# Altium project LORAbridge.PrjPcb
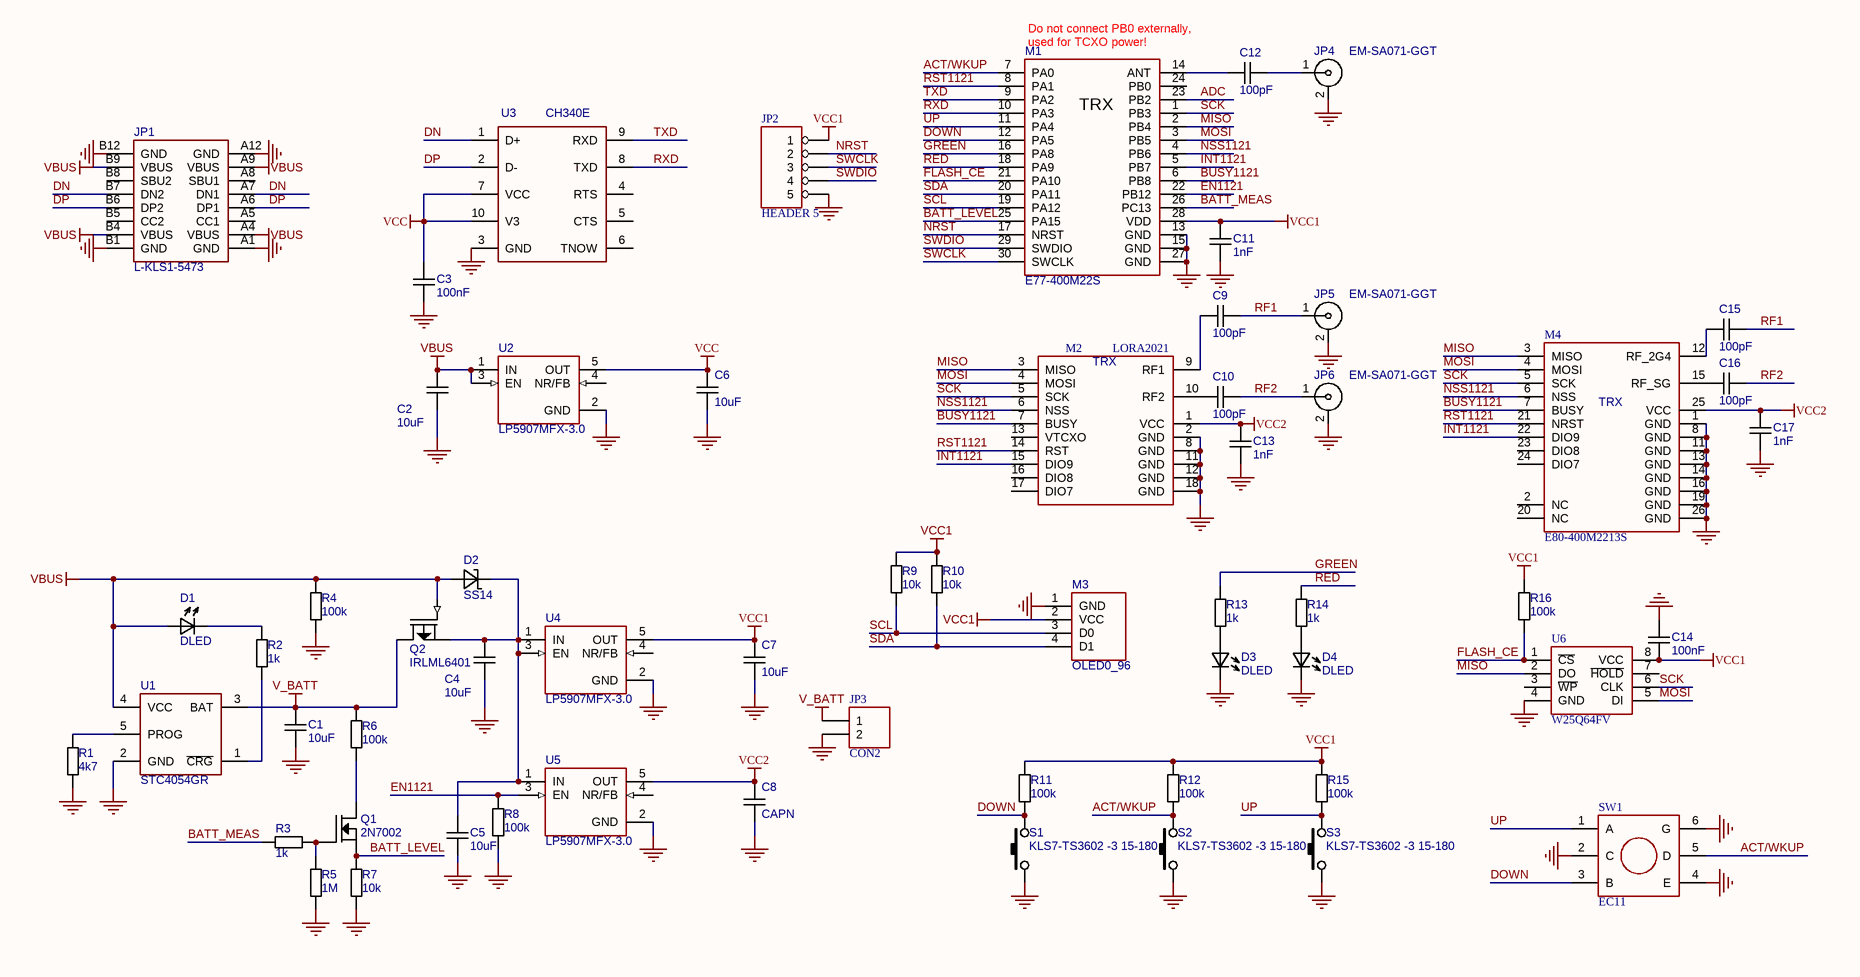
[diagram p0: LB77.SchDoc]
1 sheet, 59 parts. Net scope: global (net labels, ports and power ports of the same name join across sheets).
Board file: LB77.PcbDoc

## Sheet LB77.SchDoc
size 420 x 297 mm; SheetNumber: 1; SheetTotal: 1

### Parts
C1  10uF  [C-0805]
C2  10uF  [C-0805]
C3  100nF  [C-0603]
C4  10uF  [C-0805]
C5  10uF  [C-0805]
C6  10uF  [C-0805]
C7  10uF  [C-0805]
C8  CAPN  [C-0805]
C9  100pF  [C-0603]
C10  100pF  [C-0603]
C11  1nF  [C-0603]
C12  100pF  [C-0603]
C13  1nF  [C-0603]
C14  100nF  [C-0603]
C15  100pF  [C-0603]
C16  100pF  [C-0603]
C17  1nF  [C-0603]
D1  DLED  [LED_3mm_RED]
D2  SS14  [D-SMA]
D3  DLED  [LED_3mm_RED]
D4  DLED  [LED_3mm_RED]
JP1  L-KLS1-5473  [USB_C_SMD_SLOT]
JP2  HEADER 5  [PLS1-5]
JP3  CON2  [WH-02R]
JP4  EM-SA071-GGT  [SMA_F_EDGE]
JP5  EM-SA071-GGT  [SMA_F_EDGE]
JP6  EM-SA071-GGT  [SMA_F_EDGE]
M1  E77-400M22S  [E77XX-M22]
M2  LORA2021  [LORA1121]
M3  OLED0_96  [OLED096_I2C]
M4  E80-400M2213S  [E80]
Q1  2N7002  [SOT-23]
Q2  IRLML6401  [SOT-23]
R1  4k7  [R-0603]
R2  1k  [R-0603]
R3  1k  [R-0603]
R4  100k  [R-0603]
R5  1M  [R-0603]
R6  100k  [R-0603]
R7  10k  [R-0603]
R8  100k  [R-0603]
R9  10k  [R-0603]
R10  10k  [R-0603]
R11  100k  [R-0603]
R12  100k  [R-0603]
R13  1k  [R-0603]
R14  1k  [R-0603]
R15  100k  [R-0603]
R16  100k  [R-0603]
S1  KLS7-TS3602 -3 15-180  [KN_MIN]
S2  KLS7-TS3602 -3 15-180  [KN_MIN]
S3  KLS7-TS3602 -3 15-180  [KN_MIN]
SW1  EC11  [EC11]
U1  STC4054GR  [SOT-23-5]
U2  LP5907MFX-3.0  [SOT-23-5]
U3  CH340E  [MSOP-10]
U4  LP5907MFX-3.0  [SOT-23-5]
U5  LP5907MFX-3.0  [SOT-23-5]
U6  W25Q64FV  [SOIC8-208]

### Nets
GND: C1.2 C2.2 C3.2 C4.2 C5.2 C6.2 C7.2 C8.2 C11.2 C13.2 C14.1 C17.2 D3.2 D4.2 JP1.A1(GND) JP1.A12(GND) JP1.B1(GND) JP1.B12(GND) JP2.5 JP3.2 JP4.2 JP5.2 JP6.2 M1.13(GND) M1.15(GND) M1.27(GND) M2.2(GND) M2.8(GND) M2.11(GND) M2.12(GND) M2.18(GND) M3.1(GND) M4.1(GND) M4.8(GND) M4.11(GND) M4.13(GND) M4.14(GND) M4.16(GND) M4.19(GND) M4.26(GND) R1.1 R4.1 R5.1 R7.1 R8.1 S1.1 S2.1 S3.1 SW1.2(C) SW1.4(E) SW1.6(G) U1.2(GND) U2.2(GND) U3.3(GND) U4.2(GND) U5.2(GND) U6.4(GND)
V_BATT: C1.1 JP3.1 Q2.3(DRAIN) R6.2 U1.3(BAT)
VBUS: C2.1 D1.1 D2.1 JP1.A4(VBUS) JP1.A9(VBUS) JP1.B4(VBUS) JP1.B9(VBUS) Q2.1(GATE) R4.2 U1.4(VCC) U2.1(IN) U2.3(EN)
VCC: C3.1 C6.1 U2.5(OUT) U3.7(VCC) U3.10(V3)
VCC1: C7.1 C11.1 C14.2 JP2.1 M1.28(VDD) M3.2(VCC) R9.2 R10.2 R11.2 R12.2 R15.2 R16.2 U4.5(OUT) U6.8(VCC)
VCC2: C8.1 C13.1 C17.1 M2.1(VCC) M4.25(VCC) U5.5(OUT)
ACT/WKUP: M1.7(PA0) R12.1 S2.2 SW1.5(D)
ADC: M1.23(PB2)
BATT_LEVEL: M1.25(PA15) Q1.2(SOURCE) R7.2
BATT_MEAS: M1.26(PC13) R3.2
BUSY1121: M1.6(PB8) M2.7(BUSY) M4.7(BUSY)
DN: JP1.A7(DN1) JP1.B7(DN2) U3.1(D+)
DOWN: M1.12(PA5) R11.1 S1.2 SW1.3(B)
DP: JP1.A6(DP1) JP1.B6(DP2) U3.2(D-)
EN1121: M1.22(PB12) R8.2 U5.3(EN)
FLASH_CE: M1.21(PA10) R16.1 U6.1(~{CS})
GREEN: M1.16(PA8) R13.2
INT1121: M1.5(PB7) M2.15(DIO9) M4.22(DIO9)
MISO: M1.2(PB4) M2.3(MISO) M4.3(MISO) U6.2(DO)
MOSI: M1.3(PB5) M2.4(MOSI) M4.4(MOSI) U6.5(DI)
NRST: JP2.2 M1.17(NRST)
NSS1121: M1.4(PB6) M2.6(NSS) M4.6(NSS)
RED: M1.18(PA9) R14.2
RF1: C9.2 C15.2 JP5.1
RF2: C10.2 C16.2 JP6.1
RST1121: M1.8(PA1) M2.14(RST) M4.21(NRST)
RXD: M1.10(PA3) U3.8(TXD)
SCK: M1.1(PB3) M2.5(SCK) M4.5(SCK) U6.6(CLK)
SCL: M1.19(PA12) M3.3(D0) R9.1
SDA: M1.20(PA11) M3.4(D1) R10.1
SWCLK: JP2.3 M1.30(SWCLK)
SWDIO: JP2.4 M1.29(SWDIO)
TXD: M1.9(PA2) U3.9(RXD)
UP: M1.11(PA4) R15.1 S3.2 SW1.1(A)
NetC4_1: C4.1 C5.1 D2.2 Q2.2(SOURCE) U4.1(IN) U4.3(EN) U5.1(IN)
NetC9_1: C9.1 M2.9(RF1)
NetC10_1: C10.1 M2.10(RF2)
NetC12_1: C12.1 M1.14(ANT)
NetC12_2: C12.2 JP4.1
NetC15_1: C15.1 M4.12(RF_2G4)
NetC16_1: C16.1 M4.15(RF_SG)
NetD1_2: D1.2 R2.2
NetD3_1: D3.1 R13.1
NetD4_1: D4.1 R14.1
NetQ1_1: Q1.1(GATE) R3.1 R5.2
NetQ1_3: Q1.3(DRAIN) R6.1
NetR1_2: R1.2 U1.5(PROG)
NetR2_1: R2.1 U1.1(~{CRG})

Not connected (* = marked no-connect by the designer): JP1 17(VSS) A5(CC1) A8(SBU1) B5(CC2) B8(SBU2); M1 24(PB0); M2 13(VTCXO) 16(DIO8) 17(DIO7); M4 2(NC) 20(NC) 23(DIO8) 24(DIO7); U2 4(NR/FB); U3 4(RTS) 5(CTS) 6(TNOW); U4 4(NR/FB); U5 4(NR/FB); U6 3(~{WP}) 7(~{HOLD})

### Notes on the sheet
- (near M1) Do not connect PB0 externally,
  used for TCXO power!
- THIS DOCUMENT AND THE DATA DISCLOSED HEREIN OR
- HEREWITH IS THE PROPERTY OF ALTIUM LIMITED AND MAY
- DWG NO:
- REVISION
- REV:
- DESCRIPTION
- DATE
- APPROVED
- BE FREELY DISTRIBUTED IN WHOLE. NO RIGHTS ARE
- RESERVED OR EXPRESS OR IMPLIED WARANTEE GIVEN.
- ENG:
- APPROVALS
- PROJECT
- DSN:
- CHK:
- REFERENCE DOCUMENTS
- PROJECT REVISION:
- TITLE
- DOCUMENT REVISION:
- DESIGN ITEM:
- BOM:
- FAB DWG:
- PCB DWG:
- ASSY DWG:
- SCALE:
- A3
- SIZE
- CAGE CODE
- FILE NAME
- DWG NO.
- SHEET
- OF
- REV
- (in symbol E77-400M22S) TRX
- (in symbol E80) TRX
- (in symbol LORAXX21) TRX

### Library data of the parts
C1-C17 = CAPN: Voltage: 50V; Точність/група: NP0; Вид: Конденсатор
D1 D3 D4 = DLED: Вид: Світлодіод
D2 = DIODSH: Вид: Діод
JP1 = L-KLS1-5473: Mounting  Method: SMD; Value: *
JP2 = HEADER 5: Вид: Роз'єм; *: *
JP3 = CON2: Вид: Роз'єм; *: *
JP4-JP6 = SMA: SMA Female R/A PCB Mount; Вид: Роз'єм
M2 = LORAXX21
M3 = OLED0_96_I2C
M4 = E80
Q1 = MOSF-N: Вид: Транзистор
Q2 = MOSF-P: Вид: Транзистор
R1-R16 = RES: Точність/група: 5%; Вид: Резистор
S1-S3 = SW-1: Вид: Кнопка; Робоча напруга: *
U1 = STC4054
U2 U4 U5 = LP5907: 250mA Low-Dropout Regulator; Вид: Мікросхема
U3 = CH340E: Value: {Value}; Mounting  Method: SMD
U6 = W25Q64FV: Вид: Мікросхема